# Altium schematic sheet S7500_Drv.SchDoc
size A2; SheetNumber: 2; SheetTotal: 6
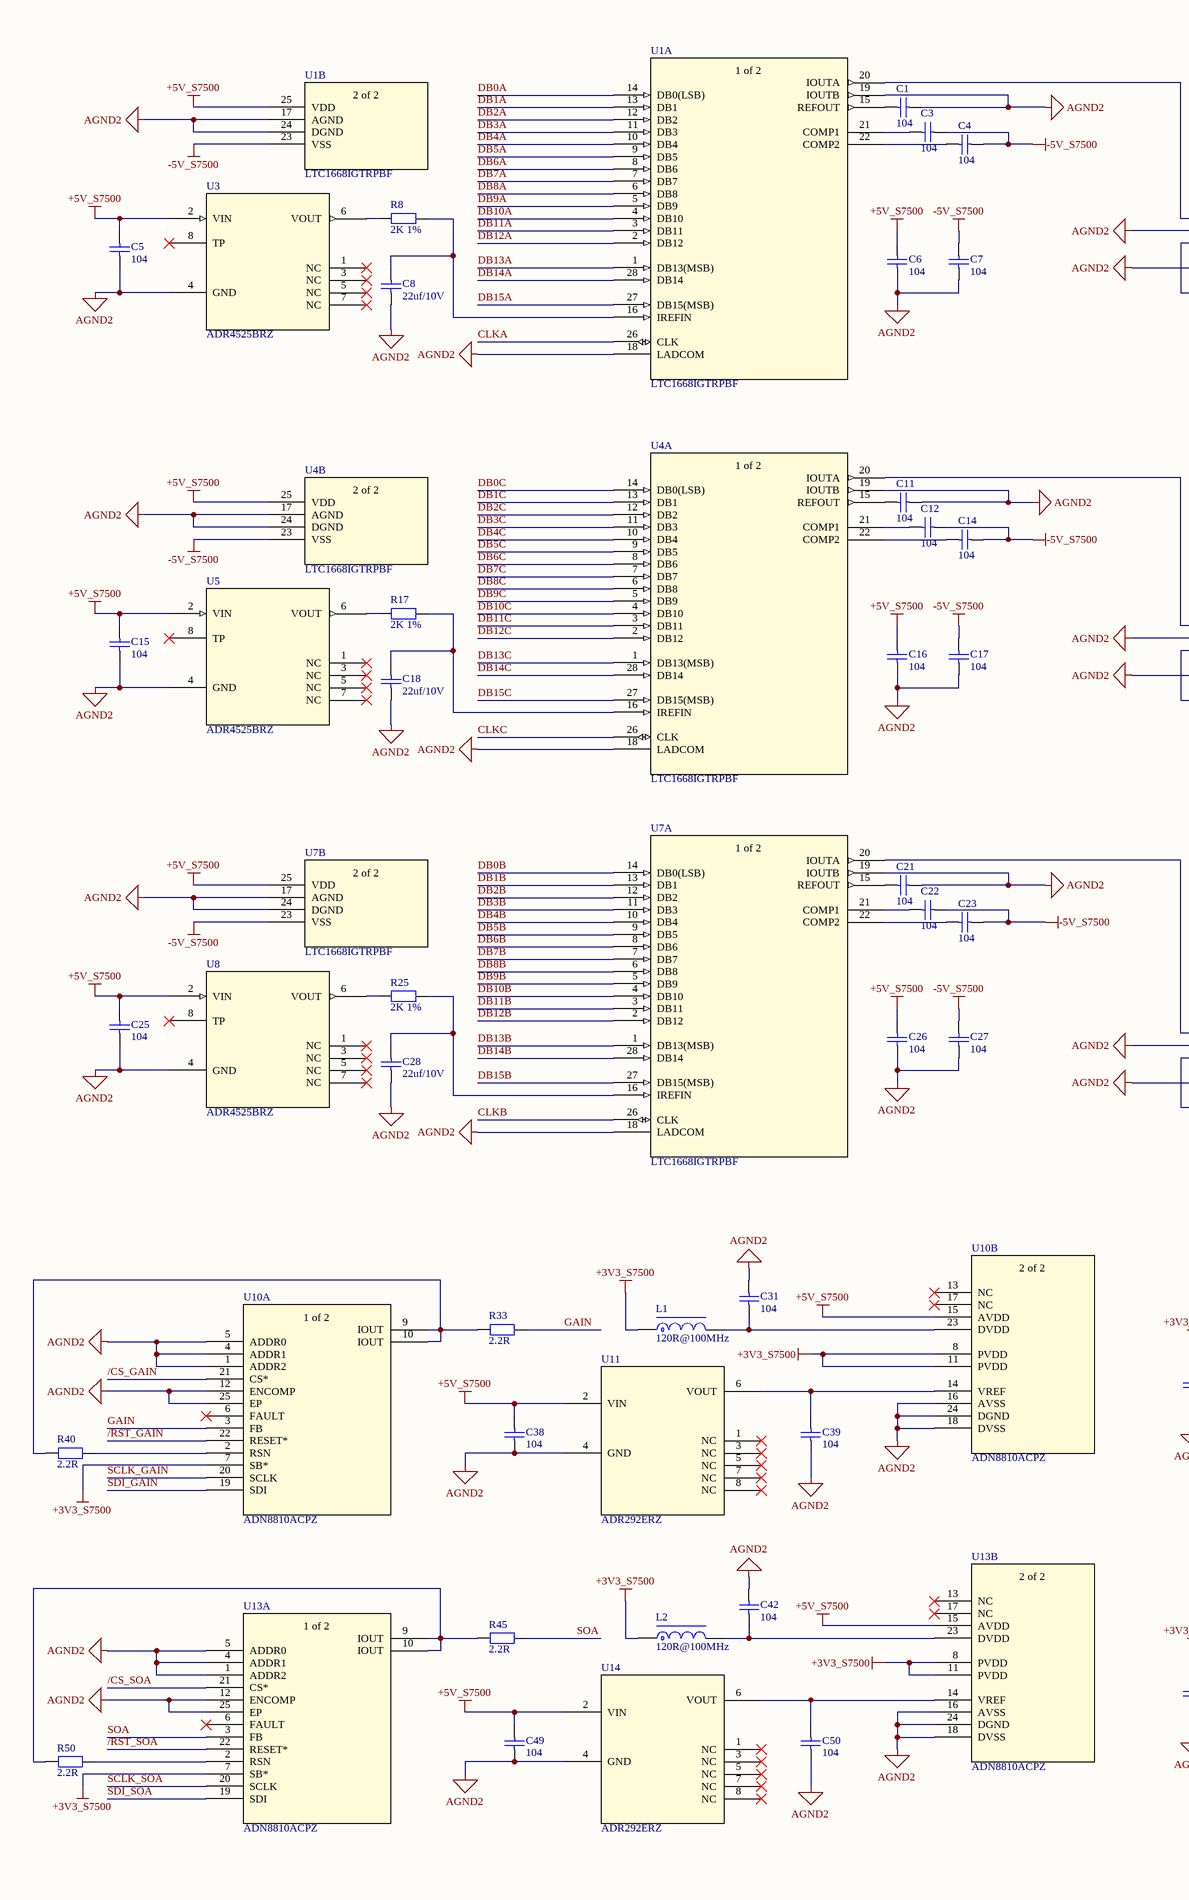
[diagram p0: S7500_Drv.SchDoc, left]
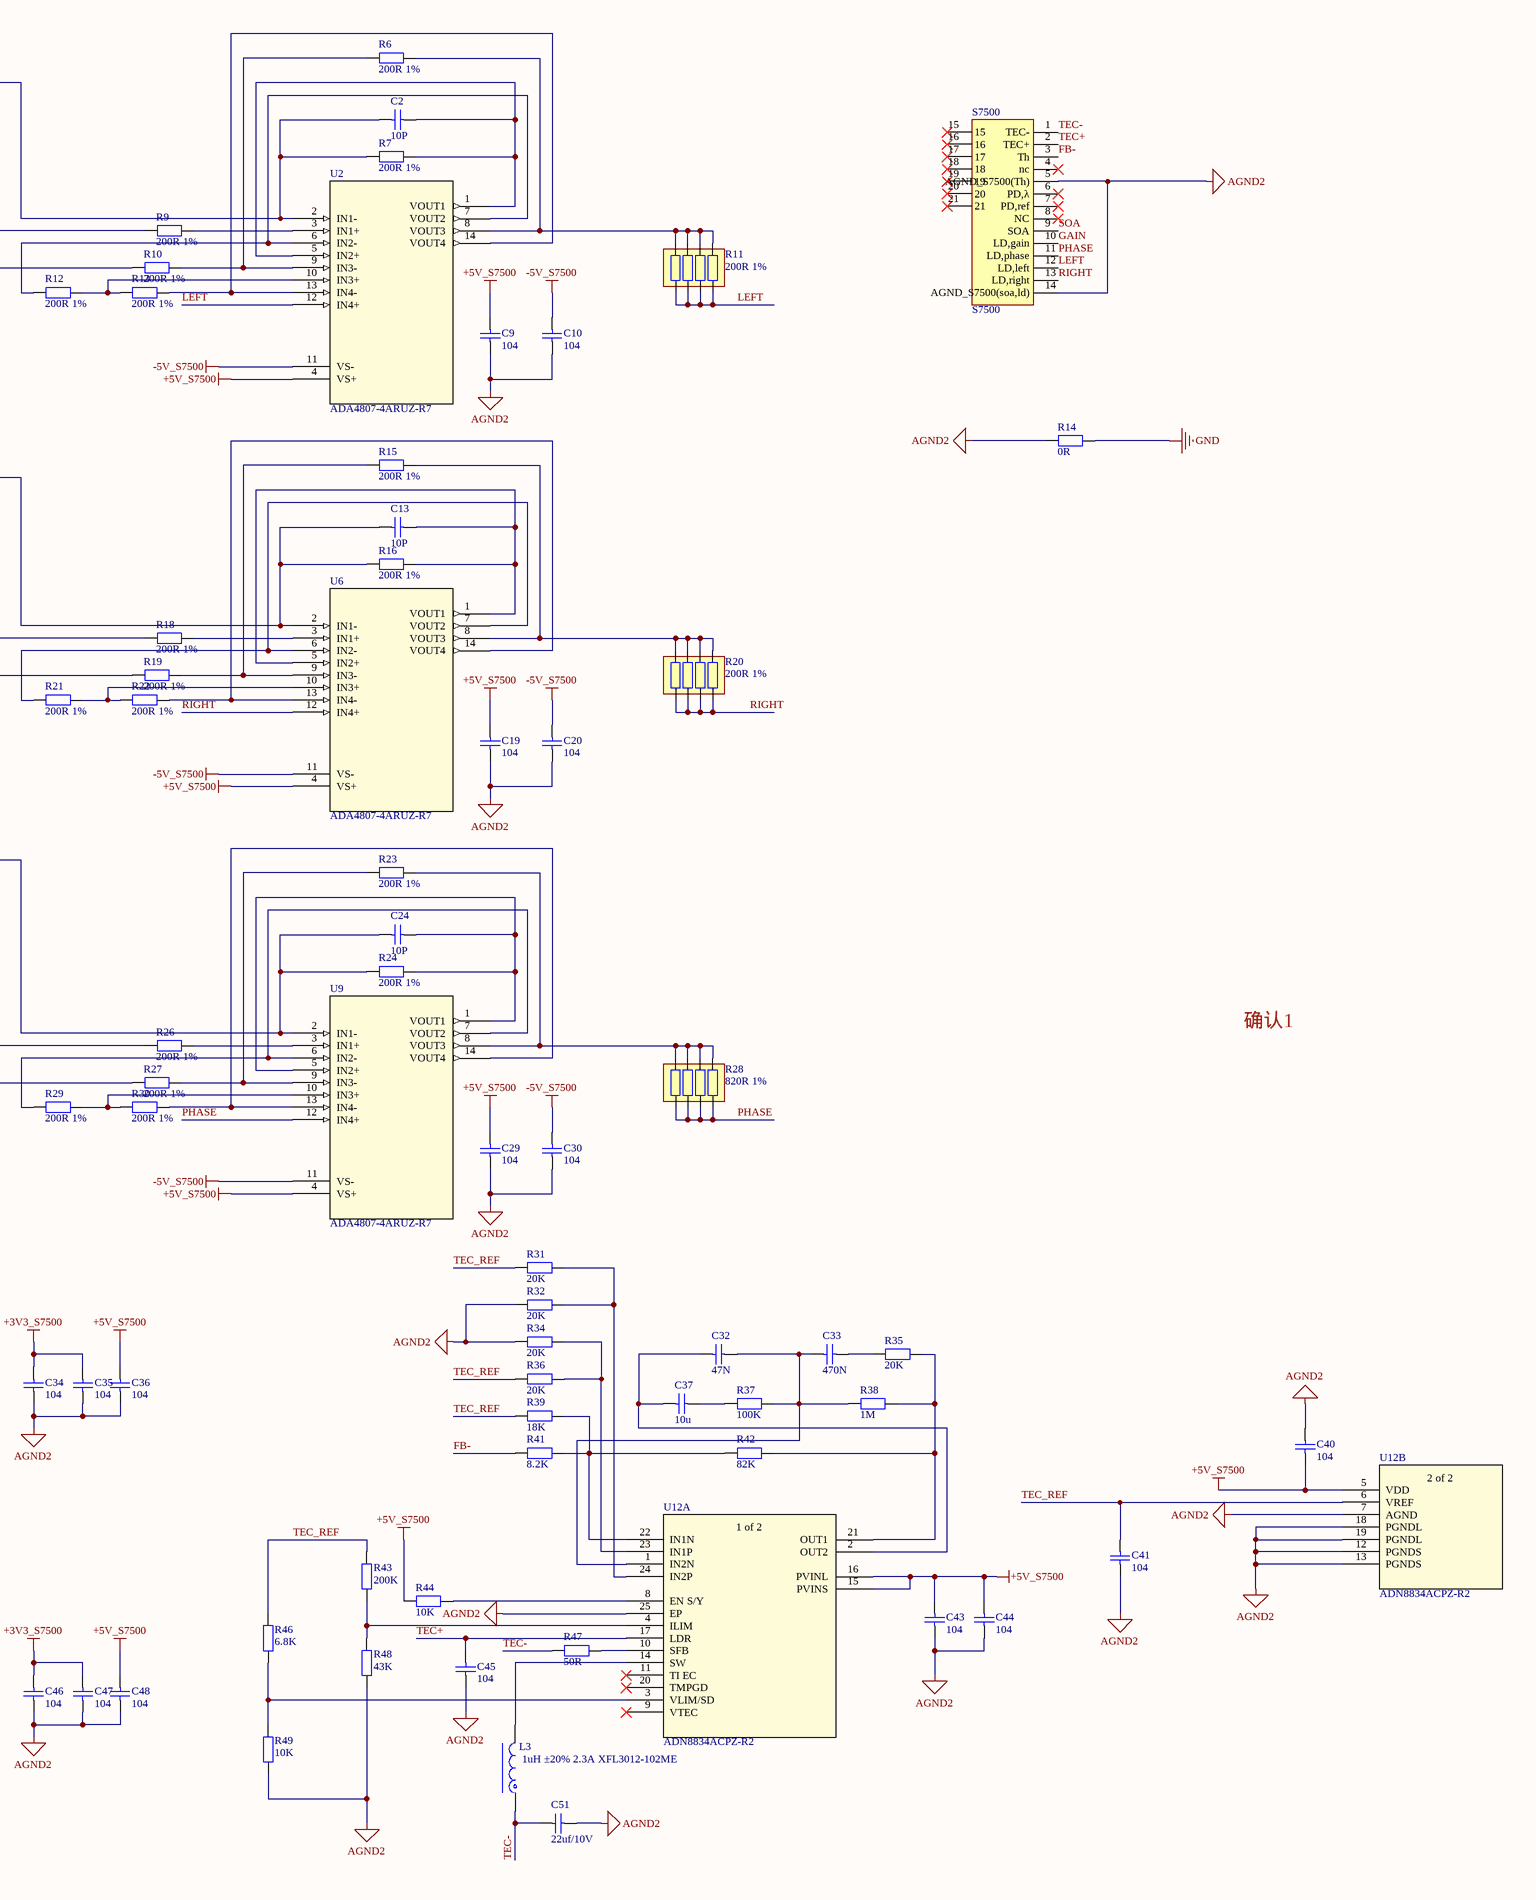
[diagram p1: S7500_Drv.SchDoc, right]

## Parts
C1  104  [C0402_L]
C2  10P  [C0402_L]
C3  104  [C0402_L]
C4  104  [C0402_L]
C5  104  [C0402_L]
C6  104  [C0402_L]
C7  104  [C0402_L]
C8  22uf/10V  [C0402_L]
C9  104  [C0402_L]
C10  104  [C0402_L]
C11  104  [C0402_L]
C12  104  [C0402_L]
C13  10P  [C0402_L]
C14  104  [C0402_L]
C15  104  [C0402_L]
C16  104  [C0402_L]
C17  104  [C0402_L]
C18  22uf/10V  [C0402_L]
C19  104  [C0402_L]
C20  104  [C0402_L]
C21  104  [C0402_L]
C22  104  [C0402_L]
C23  104  [C0402_L]
C24  10P  [C0402_L]
C25  104  [C0402_L]
C26  104  [C0402_L]
C27  104  [C0402_L]
C28  22uf/10V  [C0402_L]
C29  104  [C0402_L]
C30  104  [C0402_L]
C31  104  [C0402_L]
C32  47N  [C0402_L]
C33  470N  [C0402_L]
C34  104  [C0402_L]
C35  104  [C0402_L]
C36  104  [C0402_L]
C37  10u  [C0402_L]
C38  104  [C0402_L]
C39  104  [C0402_L]
C40  104  [C0402_L]
C41  104  [C0402_L]
C42  104  [C0402_L]
C43  104  [C0402_L]
C44  104  [C0402_L]
C45  104  [C0402_L]
C46  104  [C0402_L]
C47  104  [C0402_L]
C48  104  [C0402_L]
C49  104  [C0402_L]
C50  104  [C0402_L]
C51  22uf/10V  [C0402_L]
L1  120R@100MHz  [FB0402]
L2  120R@100MHz  [FB0402]
L3  1uH ±20% 2.3A XFL3012-102ME  [SWPA3015]
R6  200R 1%  [R0402_L]
R7  200R 1%  [R0402_L]
R8  2K 1%  [R0402_L]
R9  200R 1%  [R0402_L]
R10  200R 1%  [R0402_L]
R11  200R 1%  [RCA-8P4R-0603]
R12  200R 1%  [R0402_L]
R13  200R 1%  [R0402_L]
R14  0R  [R0402_L]
R15  200R 1%  [R0402_L]
R16  200R 1%  [R0402_L]
R17  2K 1%  [R0402_L]
R18  200R 1%  [R0402_L]
R19  200R 1%  [R0402_L]
R20  200R 1%  [RCA-8P4R-0603]
R21  200R 1%  [R0402_L]
R22  200R 1%  [R0402_L]
R23  200R 1%  [R0402_L]
R24  200R 1%  [R0402_L]
R25  2K 1%  [R0402_L]
R26  200R 1%  [R0402_L]
R27  200R 1%  [R0402_L]
R28  820R 1%  [RCA-8P4R-0603]
R29  200R 1%  [R0402_L]
R30  200R 1%  [R0402_L]
R31  20K  [R0402_L]
R32  20K  [R0402_L]
R33  2.2R  [R0603_L]
R34  20K  [R0402_L]
R35  20K  [R0402_L]
R36  20K  [R0402_L]
R37  100K  [R0402_L]
R38  1M  [R0402_L]
R39  18K  [R0402_L]
R40  2.2R  [R0603_L]
R41  8.2K  [R0402_L]
R42  82K  [R0402_L]
R43  200K  [R0402_L]
R44  10K  [R0402_L]
R45  2.2R  [R0603_L]
R46  6.8K  [R0402_L]
R47  50R  [R0402_L]
R48  43K  [R0402_L]
R49  10K  [R0402_L]
R50  2.2R  [R0603_L]
S7500  S7500  [S7500-14*0.8mm]
U1  LTC1668IGTRPBF  [SSOP-28_G_LIT]  (parts A,B of 2)
U2  ADA4807-4ARUZ-R7  [RU-14_ADI]
U3  ADR4525BRZ  [R_8_ADI]
U4  LTC1668IGTRPBF  [SSOP-28_G_LIT]  (parts A,B of 2)
U5  ADR4525BRZ  [R_8_ADI]
U6  ADA4807-4ARUZ-R7  [RU-14_ADI]
U7  LTC1668IGTRPBF  [SSOP-28_G_LIT]  (parts A,B of 2)
U8  ADR4525BRZ  [R_8_ADI]
U9  ADA4807-4ARUZ-R7  [RU-14_ADI]
U10  ADN8810ACPZ  [CP_24_1_ADI]  (parts A,B of 2)
U11  ADR292ERZ  [R_8_ADI]
U12  ADN8834ACPZ-R2  [CP_24_7_ADI]  (parts A,B of 2)
U13  ADN8810ACPZ  [CP_24_1_ADI]  (parts A,B of 2)
U14  ADR292ERZ  [R_8_ADI]

## Nets
+3V3_S7500: C34.2 C35.2 C46.2 C47.2 L1.1 L2.1 U10.7(SB*) U10.8(PVDD) U10.11(PVDD) U13.7(SB*) U13.8(PVDD) U13.11(PVDD)
+5V_S7500: C5.2 C6.2 C9.2 C15.2 C16.2 C19.2 C25.2 C26.2 C29.2 C36.2 C38.2 C40.1 C43.2 C44.2 C48.2 C49.2 R44.1 U1.25(VDD) U2.4(VS+) U3.2(VIN) U4.25(VDD) U5.2(VIN) U6.4(VS+) U7.25(VDD) U8.2(VIN) U9.4(VS+) U10.15(AVDD) U11.2(VIN) U12.5(VDD) U12.15(PVINS) U12.16(PVINL) U13.15(AVDD) U14.2(VIN)
-5V_S7500: C3.2 C4.2 C7.2 C10.2 C12.2 C14.2 C17.2 C20.2 C22.2 C23.2 C27.2 C30.2 U1.23(VSS) U2.11(VS-) U4.23(VSS) U6.11(VS-) U7.23(VSS) U9.11(VS-)
AGND2: C1.2 C5.1 C6.1 C7.1 C8.1 C9.1 C10.1 C11.2 C15.1 C16.1 C17.1 C18.1 C19.1 C20.1 C21.2 C25.1 C26.1 C27.1 C28.1 C29.1 C30.1 C31.2 C34.1 C35.1 C36.1 C38.1 C39.1 C40.2 C41.1 C42.2 C43.1 C44.1 C45.1 C46.1 C47.1 C48.1 C49.1 C50.1 C51.1 R9.1 R10.1 R14.1 R18.1 R19.1 R26.1 R27.1 R32.1 R34.1 R48.1 R49.1 S7500.5(AGND_S7500(Th)) S7500.14(AGND_S7500(soa,ld)) U1.17(AGND) U1.18(LADCOM) U1.19(IOUTB) U1.24(DGND) U3.4(GND) U4.17(AGND) U4.18(LADCOM) U4.19(IOUTB) U4.24(DGND) U5.4(GND) U7.17(AGND) U7.18(LADCOM) U7.19(IOUTB) U7.24(DGND) U8.4(GND) U10.1(ADDR2) U10.4(ADDR1) U10.5(ADDR0) U10.12(ENCOMP) U10.16(AVSS) U10.18(DVSS) U10.24(DGND) U10.25(EP) U11.4(GND) U12.7(AGND) U12.12(PGNDS) U12.13(PGNDS) U12.18(PGNDL) U12.19(PGNDL) U12.25(EP) U13.1(ADDR2) U13.4(ADDR1) U13.5(ADDR0) U13.12(ENCOMP) U13.16(AVSS) U13.18(DVSS) U13.24(DGND) U13.25(EP) U14.4(GND)
GND: R14.2
/CS_GAIN: U10.21(CS*)
/CS_SOA: U13.21(CS*)
/RST_GAIN: U10.22(RESET*)
/RST_SOA: U13.22(RESET*)
CLKA: U1.26(CLK)
CLKB: U7.26(CLK)
CLKC: U4.26(CLK)
DB0A: U1.14(DB0(LSB))
DB0B: U7.14(DB0(LSB))
DB0C: U4.14(DB0(LSB))
DB1A: U1.13(DB1)
DB1B: U7.13(DB1)
DB1C: U4.13(DB1)
DB2A: U1.12(DB2)
DB2B: U7.12(DB2)
DB2C: U4.12(DB2)
DB3A: U1.11(DB3)
DB3B: U7.11(DB3)
DB3C: U4.11(DB3)
DB4A: U1.10(DB4)
DB4B: U7.10(DB4)
DB4C: U4.10(DB4)
DB5A: U1.9(DB5)
DB5B: U7.9(DB5)
DB5C: U4.9(DB5)
DB6A: U1.8(DB6)
DB6B: U7.8(DB6)
DB6C: U4.8(DB6)
DB7A: U1.7(DB7)
DB7B: U7.7(DB7)
DB7C: U4.7(DB7)
DB8A: U1.6(DB8)
DB8B: U7.6(DB8)
DB8C: U4.6(DB8)
DB9A: U1.5(DB9)
DB9B: U7.5(DB9)
DB9C: U4.5(DB9)
DB10A: U1.4(DB10)
DB10B: U7.4(DB10)
DB10C: U4.4(DB10)
DB11A: U1.3(DB11)
DB11B: U7.3(DB11)
DB11C: U4.3(DB11)
DB12A: U1.2(DB12)
DB12B: U7.2(DB12)
DB12C: U4.2(DB12)
DB13A: U1.1(DB13(MSB))
DB13B: U7.1(DB13(MSB))
DB13C: U4.1(DB13(MSB))
DB14A: U1.28(DB14)
DB14B: U7.28(DB14)
DB14C: U4.28(DB14)
DB15A: U1.27(DB15(MSB))
DB15B: U7.27(DB15(MSB))
DB15C: U4.27(DB15(MSB))
FB-: R41.1 S7500.3(Th)
GAIN: R33.2 S7500.10(LD,gain) U10.3(FB)
LEFT: R11.1 R11.2 R11.3 R11.4 S7500.12(LD,left) U2.12(IN4+)
PHASE: R28.1 R28.2 R28.3 R28.4 S7500.11(LD,phase) U9.12(IN4+)
RIGHT: R20.1 R20.2 R20.3 R20.4 S7500.13(LD,right) U6.12(IN4+)
SCLK_GAIN: U10.20(SCLK)
SCLK_SOA: U13.20(SCLK)
SDI_GAIN: U10.19(SDI)
SDI_SOA: U13.19(SDI)
SOA: R45.2 S7500.9(SOA) U13.3(FB)
TEC+: C45.2 S7500.2(TEC+) U12.17(LDR)
TEC-: C51.2 L3.1 R47.1 S7500.1(TEC-)
TEC_REF: C41.2 R31.1 R36.1 R39.1 R43.2 R46.2 U12.6(VREF)
NetC1_1: C1.1 U1.15(REFOUT)
NetC2_1: C2.1 R7.1 U1.20(IOUTA) U2.2(IN1-)
NetC2_2: C2.2 R7.2 U2.1(VOUT1) U2.5(IN2+)
NetC3_1: C3.1 U1.21(COMP1)
NetC4_1: C4.1 U1.22(COMP2)
NetC8_2: C8.2 R8.2 U1.16(IREFIN)
NetC11_1: C11.1 U4.15(REFOUT)
NetC12_1: C12.1 U4.21(COMP1)
NetC13_1: C13.1 R16.1 U4.20(IOUTA) U6.2(IN1-)
NetC13_2: C13.2 R16.2 U6.1(VOUT1) U6.5(IN2+)
NetC14_1: C14.1 U4.22(COMP2)
NetC18_2: C18.2 R17.2 U4.16(IREFIN)
NetC21_1: C21.1 U7.15(REFOUT)
NetC22_1: C22.1 U7.21(COMP1)
NetC23_1: C23.1 U7.22(COMP2)
NetC24_1: C24.1 R24.1 U7.20(IOUTA) U9.2(IN1-)
NetC24_2: C24.2 R24.2 U9.1(VOUT1) U9.5(IN2+)
NetC28_2: C28.2 R25.2 U7.16(IREFIN)
NetC31_1: C31.1 L1.2 U10.23(DVDD)
NetC32_1: C32.1 C33.2 R37.2 R38.1 U12.1(IN2N)
NetC32_2: C32.2 C37.2 U12.2(OUT2)
NetC33_1: C33.1 R35.1
NetC37_1: C37.1 R37.1
NetC39_2: C39.2 U10.14(VREF) U11.6(VOUT)
NetC42_1: C42.1 L2.2 U13.23(DVDD)
NetC50_2: C50.2 U13.14(VREF) U14.6(VOUT)
NetL3_2: L3.2 U12.14(SW)
NetR6_1: R6.1 R10.2 U2.9(IN3-)
NetR6_2: R6.2 R11.5 R11.6 R11.7 R11.8 U2.8(VOUT3)
NetR8_1: R8.1 U3.6(VOUT)
NetR9_2: R9.2 U2.3(IN1+)
NetR12_1: R12.1 U2.6(IN2-) U2.7(VOUT2)
NetR12_2: R12.2 R13.1 U2.10(IN3+)
NetR13_2: R13.2 U2.13(IN4-) U2.14(VOUT4)
NetR15_1: R15.1 R19.2 U6.9(IN3-)
NetR15_2: R15.2 R20.5 R20.6 R20.7 R20.8 U6.8(VOUT3)
NetR17_1: R17.1 U5.6(VOUT)
NetR18_2: R18.2 U6.3(IN1+)
NetR21_1: R21.1 U6.6(IN2-) U6.7(VOUT2)
NetR21_2: R21.2 R22.1 U6.10(IN3+)
NetR22_2: R22.2 U6.13(IN4-) U6.14(VOUT4)
NetR23_1: R23.1 R27.2 U9.9(IN3-)
NetR23_2: R23.2 R28.5 R28.6 R28.7 R28.8 U9.8(VOUT3)
NetR25_1: R25.1 U8.6(VOUT)
NetR26_2: R26.2 U9.3(IN1+)
NetR29_1: R29.1 U9.6(IN2-) U9.7(VOUT2)
NetR29_2: R29.2 R30.1 U9.10(IN3+)
NetR30_2: R30.2 U9.13(IN4-) U9.14(VOUT4)
NetR31_2: R31.2 R32.2 U12.24(IN2P)
NetR33_1: R33.1 R40.1 U10.9(IOUT) U10.10(IOUT)
NetR34_2: R34.2 R36.2 U12.23(IN1P)
NetR35_2: R35.2 R38.2 R42.2 U12.21(OUT1)
NetR39_2: R39.2 R41.2 R42.1 U12.22(IN1N)
NetR40_2: R40.2 U10.2(RSN)
NetR43_1: R43.1 R48.2 U12.4(ILIM)
NetR44_2: R44.2 U12.8(EN_S/Y)
NetR45_1: R45.1 R50.1 U13.9(IOUT) U13.10(IOUT)
NetR46_1: R46.1 R49.2 U12.3(VLIM/SD)
NetR47_2: R47.2 U12.10(SFB)
NetR50_2: R50.2 U13.2(RSN)

Not connected (* = marked no-connect by the designer): S7500 4(nc)* 6(PD,λ)* 7(PD,ref)* 8(NC)* 15* 16* 17* 18* 19* 20* 21*; U3 1(NC)* 3(NC)* 5(NC)* 7(NC)* 8(TP)*; U5 1(NC)* 3(NC)* 5(NC)* 7(NC)* 8(TP)*; U8 1(NC)* 3(NC)* 5(NC)* 7(NC)* 8(TP)*; U10 6(FAULT)* 13(NC)* 17(NC)*; U11 1(NC)* 3(NC)* 5(NC)* 7(NC)* 8(NC)*; U12 9(VTEC)* 11(TI_EC)* 20(TMPGD)*; U13 6(FAULT)* 13(NC)* 17(NC)*; U14 1(NC)* 3(NC)* 5(NC)* 7(NC)* 8(NC)*

## Notes on the sheet
- 确认1
- (in symbol ADN8810ACPZ, part A) 1 of 2
- (in symbol ADN8810ACPZ, part B) 2 of 2
- (in symbol ADN8834ACPZ-R2, part A) 1 of 2
- (in symbol ADN8834ACPZ-R2, part B) 2 of 2
- (in symbol LTC1668IGTRPBF, part A) 1 of 2
- (in symbol LTC1668IGTRPBF, part B) 2 of 2

## Library data of the parts
C1-C51 = C: 贴片电容/MLCC电容; BOM名称: 无极性贴片电容; 当前库版本V2023.5.31 @淘宝卖家:黄晶宝石: 最新版本发布https://item.taobao.com/item.htm?id=566775463719
L1 L2 = FB: 贴片磁珠; BOM名称: 直插磁珠; 联系下单店铺卖家 免费帮你查找封装: 联系下单店铺卖家 免费技术支持
L3 = L-SWPA: 顺络_SWPA贴片屏蔽电感; BOM名称: 功率屏蔽电感; 当前库版本V2023.5.31 @淘宝卖家:黄晶宝石: 最新版本发布https://item.taobao.com/item.htm?id=566775463719
R6-R10 R12-R19 R21-R27 R29-R50 = R: 贴片电阻; 联系下单店铺卖家 免费帮你查找封装: 联系下单店铺卖家 免费技术支持; BOM名称: 贴片电阻
R11 R20 R28 = R-8P4R: 贴片4P排阻; BOM名称: 贴片网络排阻; 当前库版本V2023.5.31 @淘宝卖家:黄晶宝石: 最新版本发布https://item.taobao.com/item.htm?id=566775463719
U1 U4 U7 = LTC1668IGTRPBF: No Description Available; Mfr_Name: Analog Devices Inc; RefDes: RefDes; Type: Type
U2 U6 U9 = ADA4807-4ARUZ-R7: No Description Available; Mfr_Name: Analog Devices Inc; Type: Linear; RefDes: RefDes
U3 U5 U8 = ADR4525BRZ: No Description Available; Mfr_Name: Analog Devices Inc; RefDes: RefDes; Type: Type
U10 U13 = ADN8810ACPZ: No Description Available; Mfr_Name: Analog Devices Inc; RefDes: RefDes; Type: Type
U11 U14 = ADR292ERZ: No Description Available; Mfr_Name: Analog Devices Inc; RefDes: RefDes; Type: Type
U12 = ADN8834ACPZ-R2: No Description Available; Mfr_Name: Analog Devices Inc; RefDes: RefDes; Type: Type